# Altium schematic sheet FILTER.SchDoc
size A4
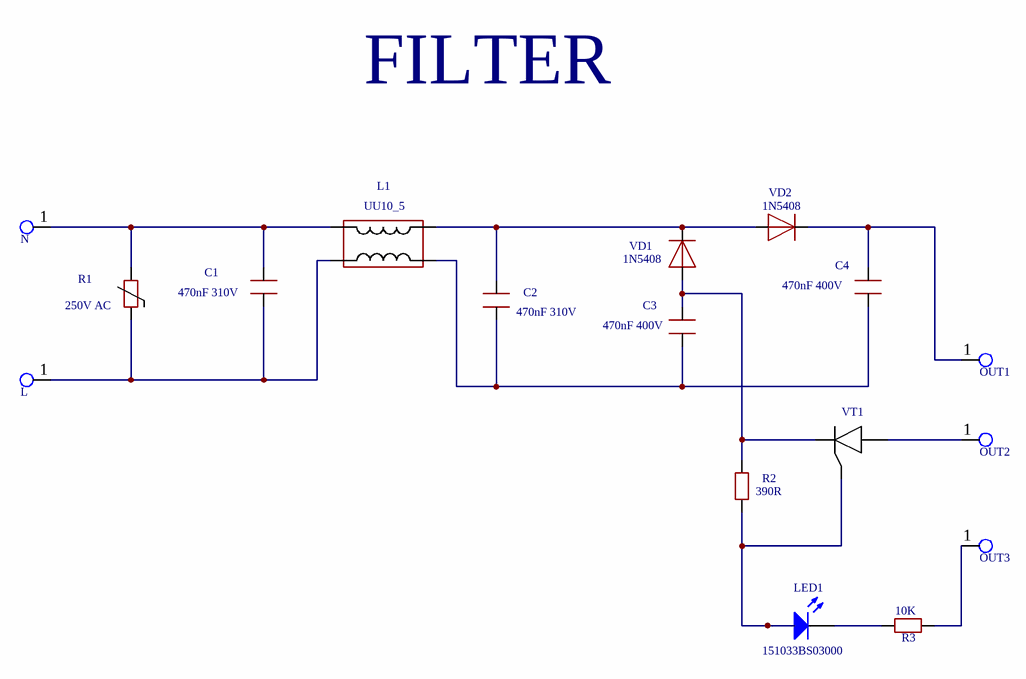
[diagram p0: FILTER.SchDoc]

## Parts
C1  470nF 310V  [CAP_FILM]
C2  470nF 310V  [CAP_FILM]
C3  470nF 400V  [CAP 225J 400V]
C4  470nF 400V  [CAP 225J 400V]
L  Test_Point_PCB  [Test_Point]  (value not drawn)
L1  UU10_5  [UU10_5]
LED1  151033BS03000  [Type 3mm]
N  Test_Point_PCB  [Test_Point]  (value not drawn)
OUT1  Test_Point_PCB  [Test_Point]  (value not drawn)
OUT2  Test_Point_PCB  [Test_Point]  (value not drawn)
OUT3  Test_Point_PCB  [Test_Point]  (value not drawn)
R1  250V AC  [VARISTOR]
R2  390R  [RES025W]
R3  10K  [RES025W]
VD1  1N5408  [1N5408]
VD2  1N5408  [1N5408]
VT1  TYN412  [TO-220-3]  (value not drawn)

## Nets
NetC1_1: C1.1(C) L.1(G9) L1.2 R1.1
NetC1_2: C1.2(A) L1.1 N.1(G9) R1.2
NetC2_1: C2.1(C) C3.2(A) C4.2(A) L1.3
NetC2_2: C2.2(A) L1.4 VD1.1(C) VD2.2(A)
NetC3_1: C3.1(C) R2.2 VD1.2(A) VT1.1
NetC4_1: C4.1(C) OUT1.1(G9) VD2.1(C)
NetLED1_1: LED1.1(K) R3.1
NetLED1_2: LED1.2(A) R2.1 VT1.3
NetOUT2_1: OUT2.1(G9) VT1.2
NetOUT3_1: OUT3.1(G9) R3.2

## Notes on the sheet
- FILTER

## Library data of the parts
C1 C2 = CAP_FILM
C3 C4 = CAP 225J 400V
L N OUT1-OUT3 = TP_PCB?: Test_Point
LED1 = 151033BS03000: THT LED round mono-color waterclear, WL-TMRW , Blue; Manufacturer: Wuerth Elektronik; ComponentLink1Description: Manufacturer URL; ComponentLink2Description: Datasheet; ComponentLink1URL: http://www.we-online.com; ComponentLink2URL: http://katalog.we-online.de/pbs/datasheet/7448042001.pdfhttp://katalog.we-online.de/pbs/datasheet/7448042001.pdfhttp://katalog.we-online.de/pbs/datasheet/7448042001.pdfhttp://katalog.we-online.de/pbs/datasheet/151033BS03000.pdf; PartNumber: 151033BS03000; Emitting color: Blue; PackageReference: Type 3mm
R1 = VARISTOR
R2 R3 = RES
VD1 VD2 = DIODE